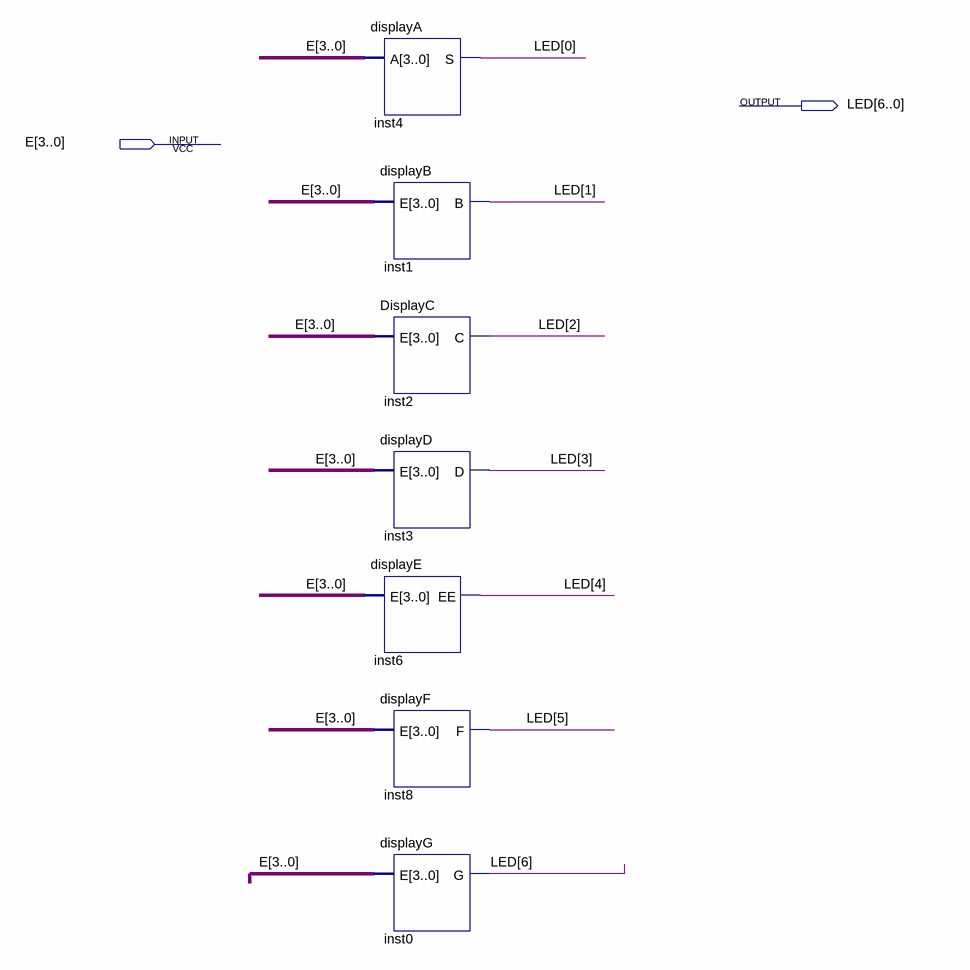
[diagram p0: schematic sheet]
// Quartus schematic BCDConverter.bdf as structural Verilog: 7 symbols, 2 pins
module BCDConverter (
  input  [3:0] E,
  output [6:0] LED
);

  displayA inst4 (.A(E), .S(LED[0]));
  displayE inst6 (.E(E), .EE(LED[4]));
  displayB inst1 (.E(E), .B(LED[1]));
  DisplayC inst2 (.E(E), .C(LED[2]));
  displayD inst3 (.E(E), .D(LED[3]));
  displayF inst8 (.E(E), .F(LED[5]));
  displayG inst0 (.E(E), .G(LED[6]));
endmodule
